# Altium project Smartlock_IEEE.PrjPcb
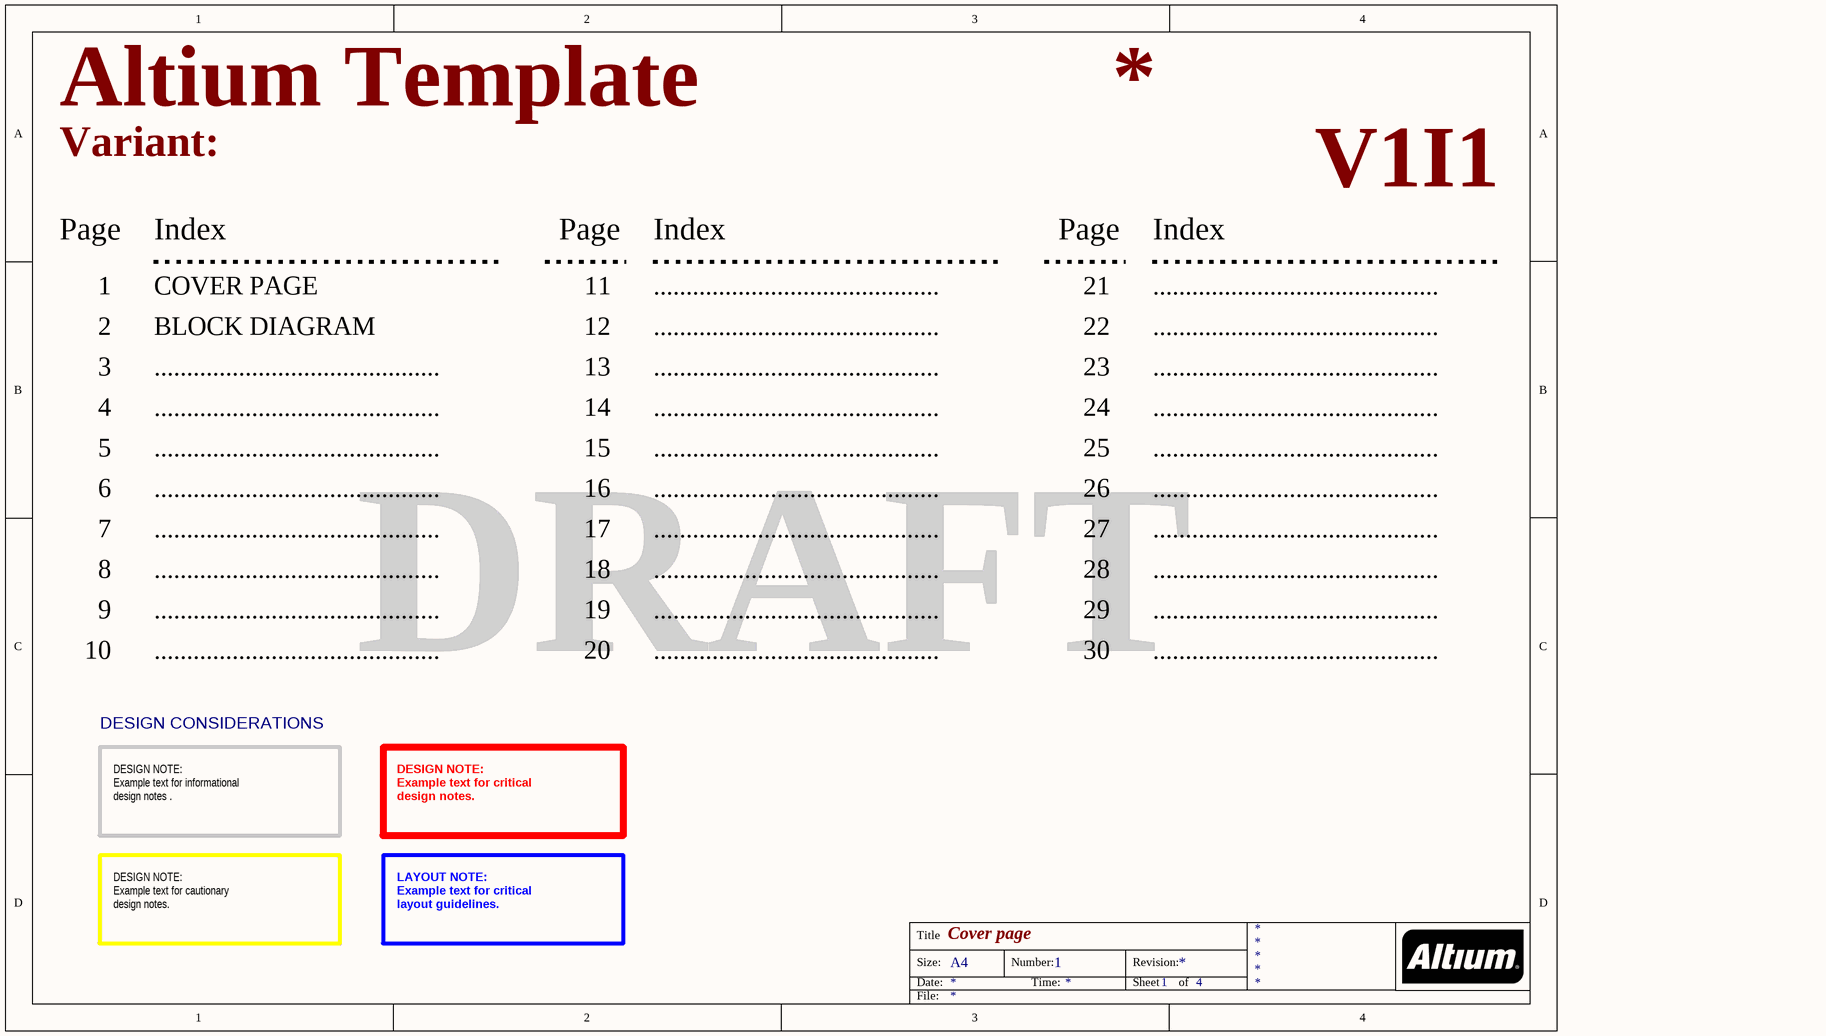
[diagram p0: [01] - COVER PAGE.SchDoc]
Company: (c) 2013 FEDEVEL www.fedevel.com; Project: Altium Template; VersionRevision: V1I1
6 sheets, 13 parts. Net scope: flat (ports and power ports of the same name join across sheets).
Sheets:
  [01] - COVER PAGE.SchDoc
  [02] - BLOCK DIAGRAM.SchDoc
  [03] - MAIN.SchDoc
  [XX] - DOC REVISION HISTORY.SchDoc
  Smartlock_IEEE.SchDoc
  Sheet2.SchDoc

## Sheet [01] - COVER PAGE.SchDoc: Cover page
size A4; DocumentNumber: 1; SheetNumber: 1; SheetTotal: 4

### Notes on the sheet
- Variant:
- Page
- Index
- V1I1
- 1
- COVER PAGE
- 11
- ............................................
- 21
- 2
- 3
- BLOCK DIAGRAM
- 12
- 13
- 22
- 23
- 4
- 14
- 24
- 5
- 6
- 15
- 16
- 25
- 26
- 7
- 8
- 17
- 18
- 27
- 28
- 9
- 19
- 29
- 10
- 20
- DRAFT
- 30
- DESIGN CONSIDERATIONS
- DESIGN NOTE:
  Example text for informational
  design notes .
- DESIGN NOTE:
  Example text for critical
  design notes.
- DESIGN NOTE:
  Example text for cautionary
  design notes.
- LAYOUT NOTE:
  Example text for critical
  layout guidelines.
- Title
- Size:
- Date:
- A4
- Number:
- Time:
- Revision:
- Sheet
- of
- File:

## Sheet [02] - BLOCK DIAGRAM.SchDoc: Block Diagram
size A4; DocumentNumber: 2; SheetNumber: 2; SheetTotal: 4
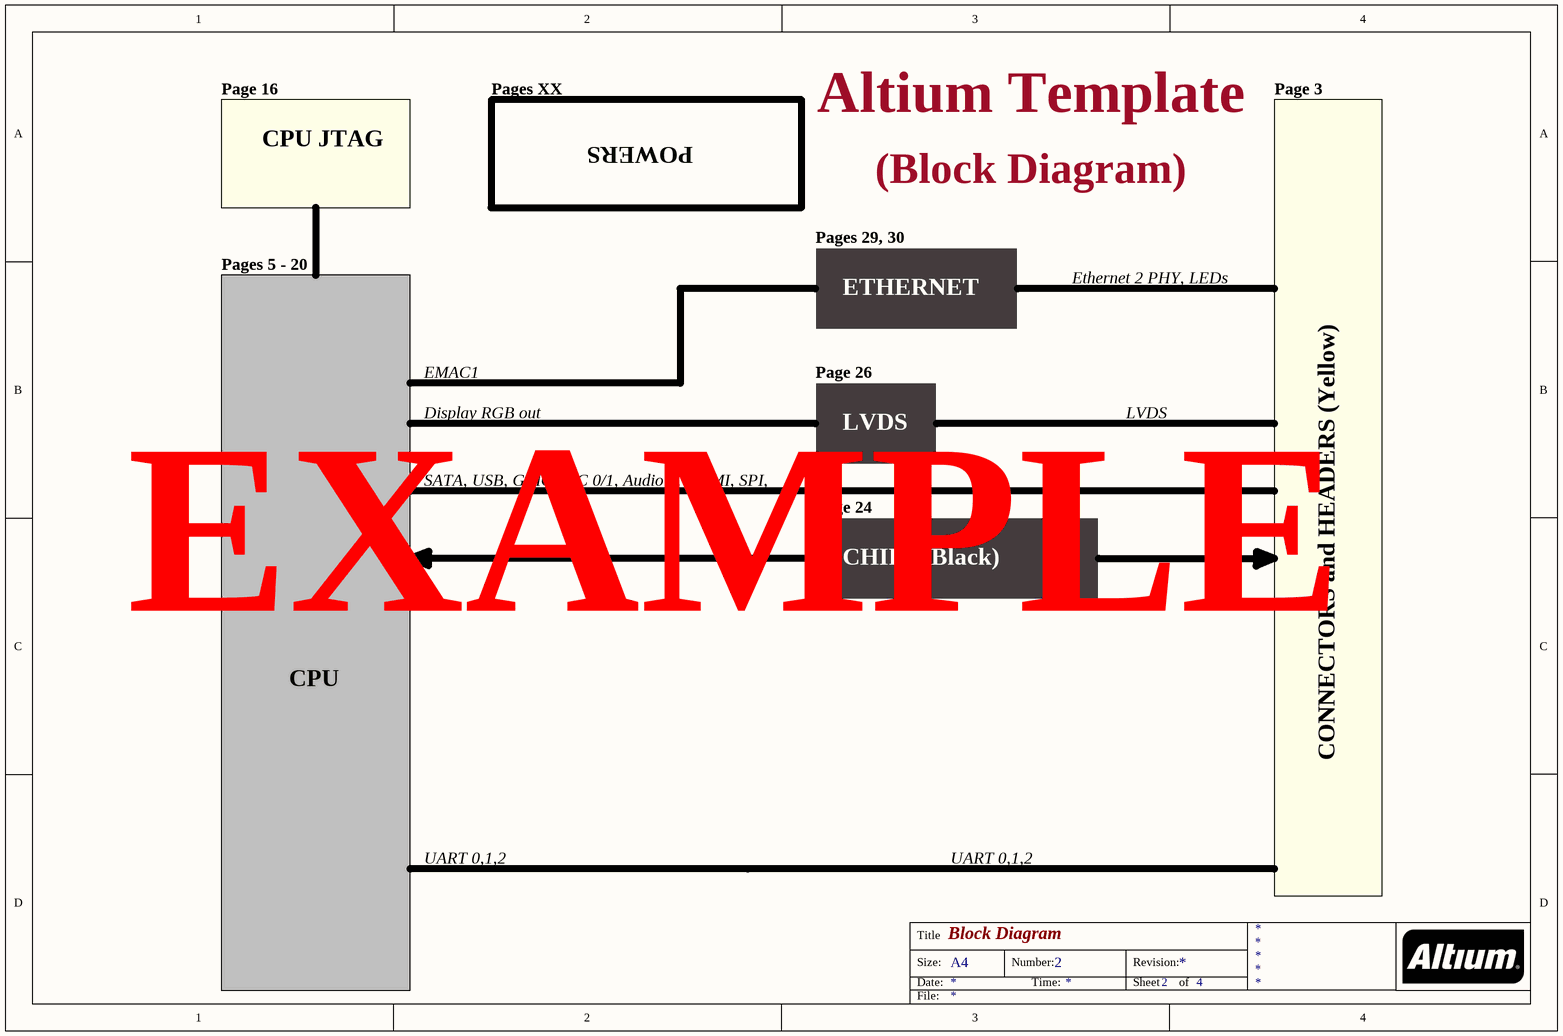
[diagram p1: [02] - BLOCK DIAGRAM.SchDoc]

### Notes on the sheet
- Page 16
- Pages XX
- Page 3
- CPU JTAG
- POWERS
- Pages 29, 30
- (Block Diagram)
- Pages 5 - 20
- ETHERNET
- Ethernet 2 PHY, LEDs
- EMAC1
- Page 26
- Display RGB out
- LVDS
- SATA, USB, GPIO, I2C 0/1, Audio 3, HDMI, SPI,
- Page 24
- CHIPS (Black)
- EXAMPLE
- CPU
- CONNECTORS and HEADERS (Yellow)
- UART 0,1,2
- FPGA
- Title
- Size:
- Date:
- A4
- Number:
- Time:
- Revision:
- Sheet
- of
- File:

## Sheet [03] - MAIN.SchDoc
size A4
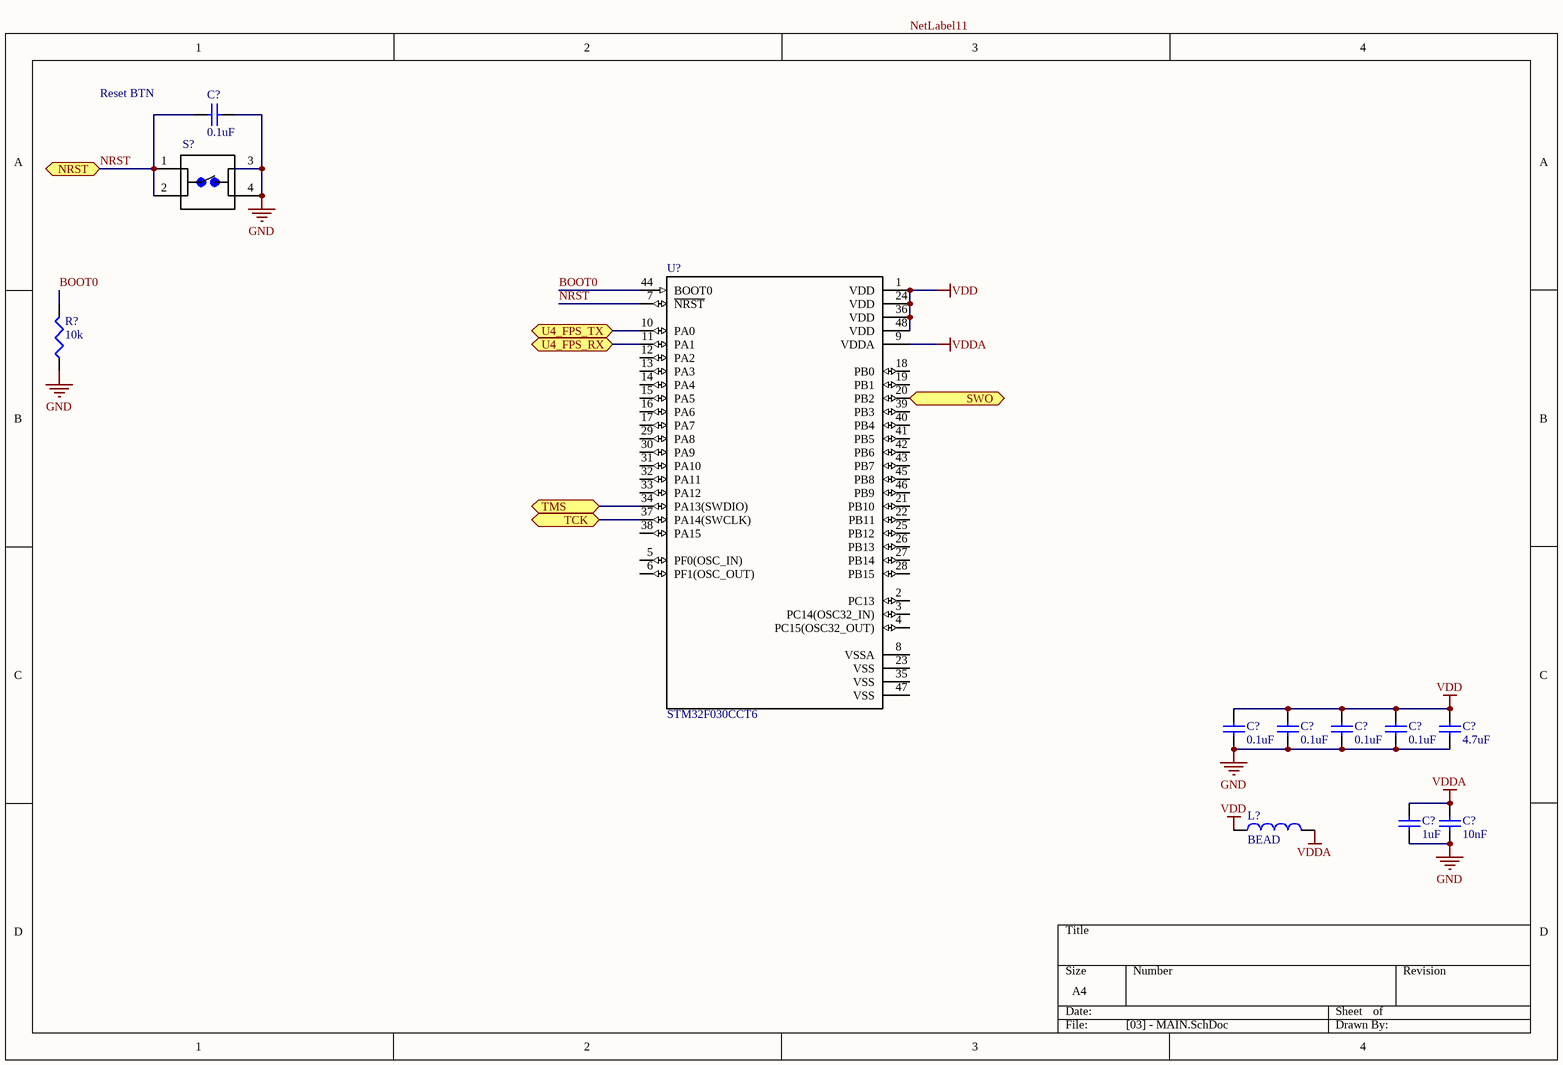
[diagram p2: [03] - MAIN.SchDoc]

### Parts
(Parts that share a designator on the sheet are numbered #1, #2 ... from top to bottom, then left to right.)
C?#1  0.1uF
C?#2  0.1uF
C?#3  0.1uF
C?#4  0.1uF
C?#5  0.1uF
C?#6  4.7uF
C?#7  1uF
C?#8  10nF
L?  BEAD
R?  10k
S?  1825910-7  [SW_1825910-7]  (value not drawn)
U?  STM32F030CCT6  [QFP50P900X900X160-48N]

### Ports
NRST, SWO, TCK, TMS, U4_FPS_RX, U4_FPS_TX

### Nets
GND: C?#1.2 C?#2.1 C?#3.1 C?#4.1 C?#5.1 C?#6.1 C?#7.1 C?#8.1 R?.1 S?.3 S?.4
VDD: C?#2.2 C?#3.2 C?#4.2 C?#5.2 C?#6.2 L?.1 U?.1(VDD) U?.24(VDD) U?.36(VDD) U?.48(VDD)
VDDA: C?#7.2 C?#8.2 L?.2 U?.9(VDDA)
BOOT0: R?.2 U?.44(BOOT0)
NRST: C?#1.1 S?.1 S?.2 U?.7(~{NRST}) ; port NRST
NetU?_10: U?.10(PA0) ; port U4_FPS_TX
NetU?_11: U?.11(PA1) ; port U4_FPS_RX
NetU?_20: U?.20(PB2) ; port SWO
NetU?_34: U?.34(PA13(SWDIO)) ; port TMS
NetU?_37: U?.37(PA14(SWCLK)) ; port TCK

Not connected (* = marked no-connect by the designer): U? 2(PC13) 3(PC14(OSC32_IN)) 4(PC15(OSC32_OUT)) 5(PF0(OSC_IN)) 6(PF1(OSC_OUT)) 8(VSSA) 12(PA2) 13(PA3) 14(PA4) 15(PA5) 16(PA6) 17(PA7) 18(PB0) 19(PB1) 21(PB10) 22(PB11) 23(VSS) 25(PB12) 26(PB13) 27(PB14) 28(PB15) 29(PA8) 30(PA9) 31(PA10) 32(PA11) 33(PA12) 35(VSS) 38(PA15) 39(PB3) 40(PB4) 41(PB5) 42(PB6) 43(PB7) 45(PB8) 46(PB9) 47(VSS)

### Notes on the sheet
- Reset BTN
- Labels drawn without touching a wire or pin: NetLabel11

### Library data of the parts
C?#1-C?#5 = CL05F104ZO5NNNC: CAP CER 0.1UF 16V Y5V 0402; Manufacturer: Samsung Electro-Mechanics; Tolerance: -20%, +80%; Temperature Coefficient: Y5V (F); Notification: Current market demand for these product types have resulted in fluctuating and extending lead times. Lead times may differ.; Checked: 0; Supplier 1: Digi-Key; Manufacturer Part Number: CL05F104ZO5NNNC; RoHS: RoHS Compliant; Category: Capacitors; Stock 1: 100000; Pricing 1: 1=0.09, 10=0.02, 100=0.009, 500=0.00642, 1000=0.00506, 2500=0.0046, 5000=0.00423 (EUR); Packaging: Cut Tape (CT); Part Status: Active; Voltage - Rated: 16V; Operating Temperature: -30°C ~ 85°C; Features: -; Ratings: -; Applications: General Purpose; Mounting Type: Surface Mount, MLCC; Package / Case: 0402 (1005 Metric); Size / Dimension: 0.039" L x 0.020" W (1.00mm x 0.50mm); Height - Seated (Max): -; Thickness (Max): 0.022" (0.55mm); Lead Spacing: -; Lead Style: -; ComponentLink1URL: http://www.samsungsem.com/kr/support/product-search/mlcc/CL05F104ZO5NNNC.jsp; ComponentLink1Description: http://www.samsungsem.com/kr/support/product-search/mlcc/CL05F104ZO5NNNC.jsp; Supplier Part Number 1: 1276-1004-1-ND
C?#6 = GRM155R60J475ME87D: CAP CER 4.7UF 6.3V X5R 0402; Manufacturer: Murata Electronics North America; Tolerance: ±20%; Notification: Current market demand for these product types have resulted in fluctuating and extending lead times. Lead times may differ.; Checked: 0; Supplier 1: Digi-Key; Manufacturer Part Number: GRM155R60J475ME87D; RoHS: RoHS Compliant; Category: Capacitors; Stock 1: 100000; Pricing 1: 1=0.15, 10=0.11, 100=0.0516, 500=0.03616, 1000=0.02994, 2500=0.02787, 5000=0.02549 (EUR); Packaging: Cut Tape (CT); Part Status: Active; Voltage - Rated: 6.3V; Temperature Coefficient: X5R; Operating Temperature: -55°C ~ 85°C; Features: -; Ratings: -; Applications: General Purpose; Mounting Type: Surface Mount, MLCC; Package / Case: 0402 (1005 Metric); Size / Dimension: 0.039" L x 0.020" W (1.00mm x 0.50mm); Height - Seated (Max): -; Thickness (Max): 0.022" (0.55mm); Lead Spacing: -; Lead Style: -; ComponentLink1URL: https://www.murata.com/~/media/webrenewal/support/library/catalog/products/capacitor/mlcc/c02e.ashx?la=en-us; ComponentLink1Description: https://www.murata.com/~/media/webrenewal/support/library/catalog/products/capacitor/mlcc/c02e.ashx?la=en-us; Supplier Part Number 1: 490-5408-1-ND
C?#7 = CL05A105KO5NNNC: CAP CER 1UF 16V X5R 0402; Manufacturer: Samsung Electro-Mechanics; Tolerance: ±10%; Notification: Current market demand for these product types have resulted in fluctuating and extending lead times. Lead times may differ.; Supplier 1: Digi-Key; Manufacturer Part Number: CL05A105KO5NNNC; RoHS: RoHS Compliant; Category: Capacitors; Stock 1: 0; Pricing 1: 1=0.07, 10=0.043, 100=0.0188, 500=0.01338, 1000=0.01052, 2500=0.00956, 5000=0.0088 (EUR); Packaging: Cut Tape (CT); Part Status: Active; Voltage - Rated: 16V; Temperature Coefficient: X5R; Operating Temperature: -55°C ~ 85°C; Features: -; Ratings: -; Applications: General Purpose; Mounting Type: Surface Mount, MLCC; Package / Case: 0402 (1005 Metric); Size / Dimension: 0.039" L x 0.020" W (1.00mm x 0.50mm); Height - Seated (Max): -; Thickness (Max): 0.022" (0.55mm); Lead Spacing: -; Lead Style: -; ComponentLink1URL: http://www.samsungsem.com/kr/support/product-search/mlcc/CL05A105KO5NNNC.jsp; ComponentLink1Description: http://www.samsungsem.com/kr/support/product-search/mlcc/CL05A105KO5NNNC.jsp; Supplier Part Number 1: 1276-1067-1-ND
C?#8 = GRM033R71A103KA01D: CAP CER 10000PF 10V X7R 0201; Manufacturer: Murata Electronics North America; Tolerance: ±10%; Notification: Current market demand for these product types have resulted in fluctuating and extending lead times. Lead times may differ.; Checked: 0; Supplier 1: Digi-Key; Manufacturer Part Number: GRM033R71A103KA01D; RoHS: RoHS Compliant; Category: Capacitors; Stock 1: 150000; Pricing 1: 1=0.09, 10=0.028, 100=0.0126, 500=0.009, 1000=0.00707, 2500=0.00643, 5000=0.00591 (EUR); Packaging: Cut Tape (CT); Part Status: Active; Voltage - Rated: 10V; Temperature Coefficient: X7R; Operating Temperature: -55°C ~ 125°C; Features: -; Ratings: -; Applications: General Purpose; Mounting Type: Surface Mount, MLCC; Package / Case: 0201 (0603 Metric); Size / Dimension: 0.024" L x 0.012" W (0.60mm x 0.30mm); Height - Seated (Max): -; Thickness (Max): 0.013" (0.33mm); Lead Spacing: -; Lead Style: -; ComponentLink1URL: https://www.murata.com/~/media/webrenewal/support/library/catalog/products/capacitor/mlcc/c02e.ashx?la=en-us; ComponentLink1Description: https://www.murata.com/~/media/webrenewal/support/library/catalog/products/capacitor/mlcc/c02e.ashx?la=en-us; Supplier Part Number 1: 490-3194-1-ND
L? = MPZ1608S300ATAH0: FERRITE BEAD 30 OHM 0603 1LN; Manufacturer: TDK Corporation; Filter Type: Power Line; Current Rating (Max): 5A; DC Resistance (DCR) (Max): 10 mOhm; Checked: 0; Supplier 1: Digi-Key; Manufacturer Part Number: MPZ1608S300ATAH0; RoHS: RoHS Compliant; Category: Filters; Stock 1: 34098; Pricing 1: 1=0.09, 10=0.067, 25=0.0608, 50=0.0548, 100=0.0401, 250=0.02916, 500=0.02674, 1000=0.02309 (EUR); Packaging: Cut Tape (CT); Part Status: Active; Ratings: -; Operating Temperature: -55°C ~ 125°C; Package / Case: 0603 (1608 Metric); Mounting Type: Surface Mount; Height (Max): 0.030" (0.75mm); Size / Dimension: 0.063" L x 0.032" W (1.60mm x 0.80mm); ComponentLink1URL: https://product.tdk.com/info/en/catalog/datasheets/beads_commercial_power_mpz1608_en.pdf; ComponentLink1Description: https://product.tdk.com/info/en/catalog/datasheets/beads_commercial_power_mpz1608_en.pdf; Supplier Part Number 1: 445-1562-1-ND
R? = RR0510P-103-D: RES SMD 10K OHM 0.5% 1/16W 0402; Manufacturer: Susumu; Power (Watts): 0.063W, 1/16W; Temperature Coefficient: ±25ppm/°C; Checked: 0; Supplier 1: Digi-Key; Manufacturer Part Number: RR0510P-103-D; RoHS: RoHS Compliant; Category: Resistors; Stock 1: 48944; Pricing 1: 1=0.07, 10=0.062, 100=0.0238, 1000=0.01048, 2500=0.00905, 5000=0.0081 (EUR); Packaging: Cut Tape (CT); Part Status: Active; Tolerance: ±0.5%; Composition: Thin Film; Features: -; Operating Temperature: -55°C ~ 125°C; Package / Case: 0402 (1005 Metric); Supplier Device Package: -; Size / Dimension: 0.039" L x 0.020" W (1.00mm x 0.50mm); Height - Seated (Max): 0.016" (0.40mm); Failure Rate: -; ComponentLink1URL: http://www.susumu.co.jp/common/pdf/n_catalog_partition05_en.pdf; ComponentLink1Description: http://www.susumu.co.jp/common/pdf/n_catalog_partition05_en.pdf; Supplier Part Number 1: RR05P10.0KDCT-ND
S? = 1825910-7_1: FSM4JAH=6MM TACT SWITCH, HIGH TEMP; MF: TE Connectivity; Contact_Current_Rating: 50 mA; Configuration_Pole-Throw: Single Pole - Single Throw; Link: http://www.te.com/usa-en/product-1825910-7.html; MP: 1825910-7; Price: 0.06 USD; Package: None; Availability: Good; SnapEDA_Link: https://www.snapeda.com/parts/1825910-7/TE%2520Connectivity%2520/%2520DEUTSCH/view-part/?ref=snap; EU_RoHS_Compliance: Compliant; Value: *
U? = STM32F030CCT6: MCU 32-Bit STM32 ARM Cortex M0 RISC 256KB Flash 2.5V/3.3V 48-Pin LQFP Tray; MF: STMicroelectronics; MP: STM32F030CCT6; Price: None; Package: LQFP-48 STMicroelectronics; Availability: Unavailable; SnapEDA_Link: https://www.snapeda.com/parts/STM32F030CCT6/STMicroelectronics/view-part/?ref=snap; Value: *

## Sheet [XX] - DOC REVISION HISTORY.SchDoc: Revision History
size A4; DocumentNumber: 3; SheetNumber: 3; SheetTotal: 4
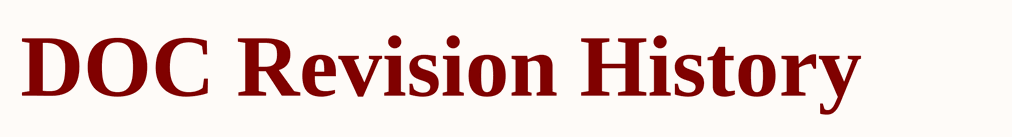
[diagram p3: [XX] - DOC REVISION HISTORY.SchDoc]

### Notes on the sheet
- DOC Revision History
- Title
- Size:
- Date:
- A4
- Number:
- Time:
- Revision:
- Sheet
- of
- File:

## Sheet Smartlock_IEEE.SchDoc
size A4; CompanyName: KDS; Organization: KDS; DocumentNumber: 4; Revision: V1I1; SheetNumber: 4; SheetTotal: 4; PageSetup: Record=PageOptions|CenterHorizontal=True|CenterVertical=True|PrintScale=1.07|XCorrection=1.00|YCorrection=1.00|PrintKind=1|BorderSize=5000000|LeftOffset=0|BottomOffset=0|Orientation=2|PaperLength=1000|PaperWidth=1000|Scale=100|PaperSource=7|PrintQuality=600|MediaType=1|DitherType=10|PaperKind=A3|PrintScaleMode=1; ProjectName: KDS C6A816x Module
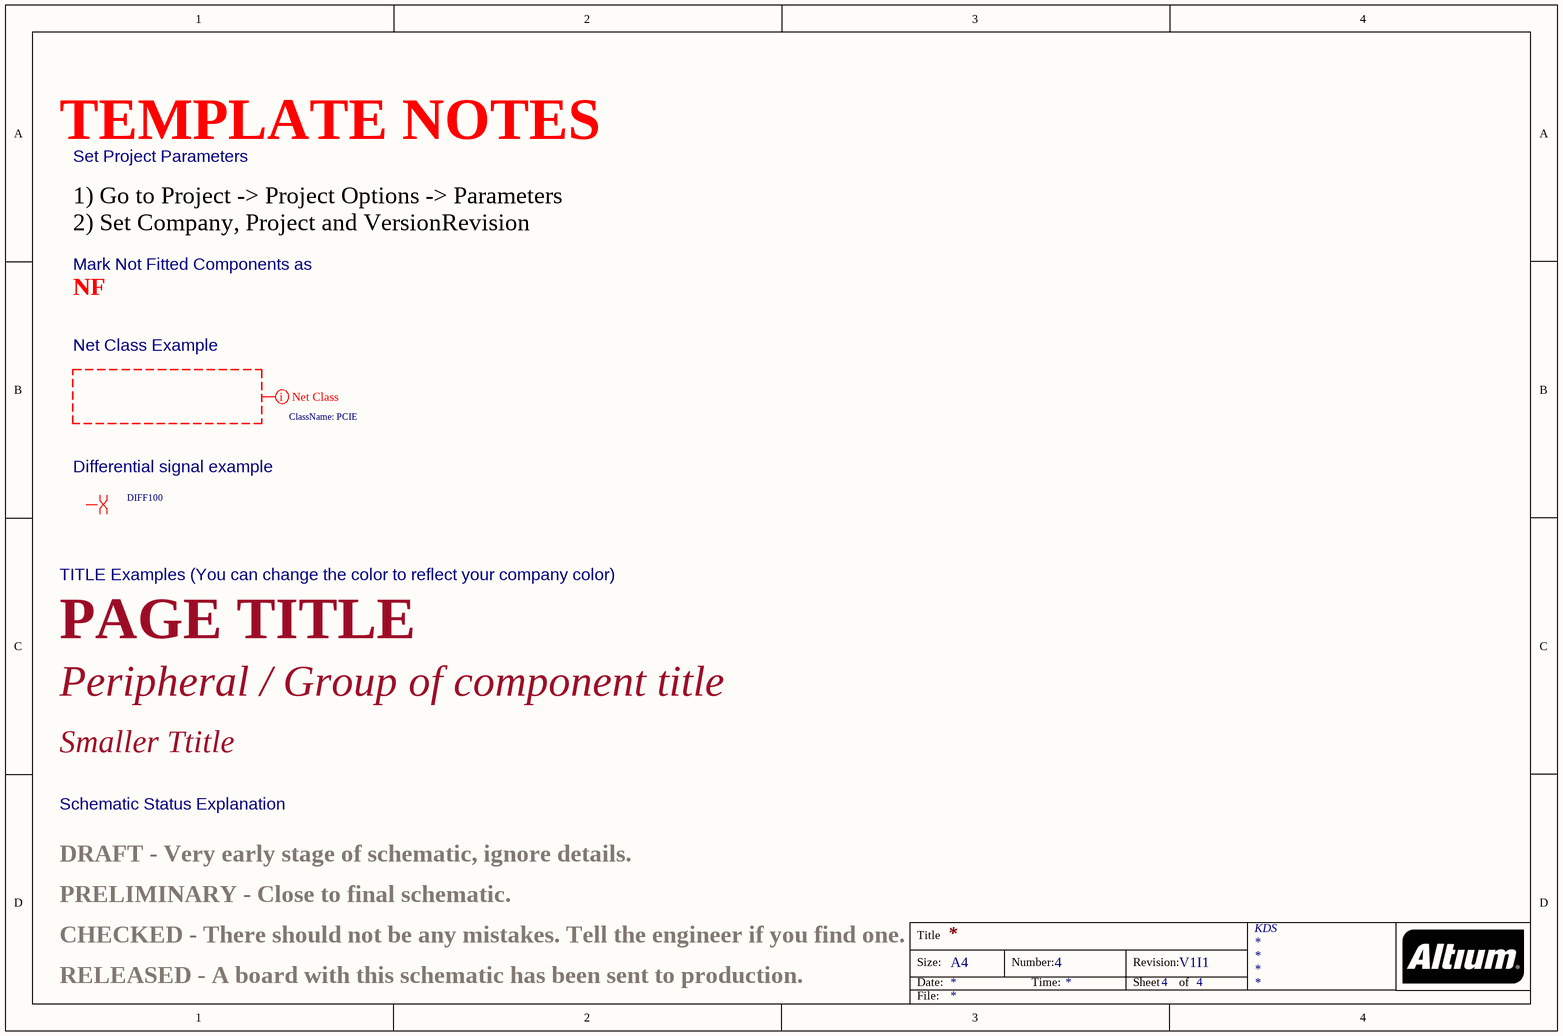
[diagram p4: Smartlock_IEEE.SchDoc]

### Layout directives
net class PCIE: (no net found under the mark)
differential pair; net class DIFF100: (no net found under the mark)

### Notes on the sheet
- TEMPLATE NOTES
- Set Project Parameters
- 1) Go to Project -> Project Options -> Parameters
  2) Set Company, Project and VersionRevision
- NF
- Mark Not Fitted Components as
- Net Class Example
- Differential signal example
- TITLE Examples (You can change the color to reflect your company color)
- PAGE TITLE
- Peripheral / Group of component title
- Smaller Ttitle
- Schematic Status Explanation
- PRELIMINARY - Close to final schematic.
- DRAFT - Very early stage of schematic, ignore details.
- RELEASED - A board with this schematic has been sent to production.
- CHECKED - There should not be any mistakes. Tell the engineer if you find one.
- Title
- Size:
- Date:
- A4
- Number:
- Time:
- Revision:
- Sheet
- of
- File:

## Sheet Sheet2.SchDoc
size A4
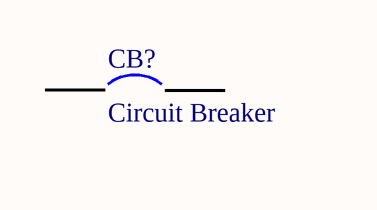
[diagram p5: Sheet2.SchDoc]

### Parts
CB?  Circuit Breaker  [SPST-2]

### Nets

Not connected (* = marked no-connect by the designer): CB? 1 2

### Library data of the parts
CB? = Circuit Breaker: Published: 24-Mar-1999; LatestRevisionDate: 17-Jul-2002; LatestRevisionNote: Re-released for DXP Platform.; PackageReference: SPST-2; Publisher: Altium Limited; PackageDescription: Switch; 2 Leads